# Altium schematic sheet 74VHCT14AM1.SchDoc
size A4; SheetNumber: 3; SheetTotal: 3
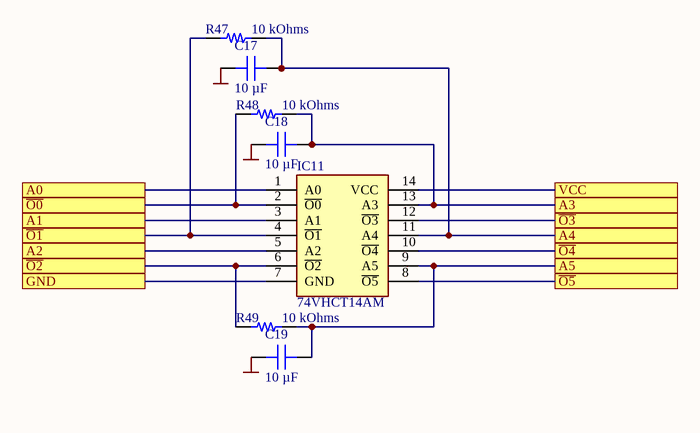
[diagram p0: 74VHCT14AM1.SchDoc]

## Parts
C17  10 µF  [CAP 0805_2012]
C18  10 µF  [CAP 0805_2012]
C19  10 µF  [CAP 0805_2012]
IC11  74VHCT14AM  [SOIC127P600X175-14N]
R47  10 kOhms  [RES 0603_1608]
R48  10 kOhms  [RES 0603_1608]
R49  10 kOhms  [RES 0603_1608]

## Ports
A0, A1, A2, A3, A4, A5, GND, VCC, ~{O0}, ~{O1}, ~{O2}, ~{O3}, ~{O4}, ~{O5}

## Nets
GND: C17.2 C18.2 C19.2
A0: IC11.1(A0) ; port A0
A1: IC11.3(A1) ; port A1
A2: IC11.5(A2) ; port A2
A3: C18.1 IC11.13(A3) R48.2 ; port A3
A4: C17.1 IC11.11(A4) R47.2 ; port A4
A5: C19.1 IC11.9(A5) R49.2 ; port A5
GND: IC11.7(GND) ; port GND  [a separate net that carries the same name]
~{O0}: IC11.2(~{O0}) R48.1 ; port ~{O0}
~{O1}: IC11.4(~{O1}) R47.1 ; port ~{O1}
~{O2}: IC11.6(~{O2}) R49.1 ; port ~{O2}
~{O3}: IC11.12(~{O3}) ; port ~{O3}
~{O4}: IC11.10(~{O4}) ; port ~{O4}
~{O5}: IC11.8(~{O5}) ; port ~{O5}
VCC: IC11.14(VCC) ; port VCC

## Library data of the parts
C17-C19 = C0805C106K8PAC7800: CAP CER 10UF 10V X5R 0805; manufacturer: KEMET; Tolerance: ±10%; Part Number: C0805C106K8PAC7800; Value: 10 µF; Applications: Bypass, Decoupling; Capacitance: 10 µF; componentlink1description: Datasheet; componentlink1url: https://connect.kemet.com:7667/gateway/IntelliData-ComponentDocumentation/1.0/download/datasheet/C0805C106K8PACTU; componentlink2description: DigiKey Link; componentlink2url: https://www.digikey.com/en/products/detail/kemet/C0805C106K8PAC7800/1090830; Device Package: 0805 (2012 Metric); lastupdated: 9/14/2022 7:51:56 AM; Lifecycle Status: Active; Minimum Order: 1; Mounting Type: Surface Mount, MLCC; Operating Temperature: -55°C ~ 85°C; Package / Case: 0805 (2012 Metric); packaging: TapeAndReel; partid: 44790; Part Status: Active; price: 0.02; series: SMD Comm X5R; Size / Dimension: 0.079" L x 0.049" W (2.00mm x 1.25mm); Supplier 1: DigiKey; Supplier Part Number 1: 399-C0805C106K8PAC7800CT-ND; Temperature Coefficient: X5R; Thickness (Max): 0.055" (1.40mm); Voltage - Rated: 10V
IC11 = 74VHCT14AM: Integrated Circuit; Manufacturer_Name: onsemi; Datasheet Link: https://docs.rs-online.com/5e2e/0900766b812cf5b5.pdf; Height: 1.75mm; Manufacturer_Part_Number: 74VHCT14AM; Mouser Part Number: 512-74VHCT14AM; Mouser Price/Stock: https://www.mouser.com/Search/Refine.aspx?Keyword=512-74VHCT14AM; Arrow Part Number: 74VHCT14AM; Arrow Price/Stock: https://www.arrow.com/en/products/74vhct14am/on-semiconductor
R47-R49 = RT0603FRE0710KL: RES SMD 10K OHM 1% 1/10W 0603; Manufacturer: Yageo; Power (Watts): 0.1W, 1/10W; Temperature Coefficient: ±50ppm/°C; Part Number: RT0603FRE0710KL; Value: 10 kOhms; ComponentLink1Description: Datasheet; ComponentLink1URL: https://www.yageo.com/upload/media/product/productsearch/datasheet/rchip/PYu-RT_1-to-0.01_RoHS_L_11.pdf; ComponentLink2Description: DigiKey Link; ComponentLink2URL: http://digikey.com/product-detail/en/yageo/RT0603FRE0710KL/YAG2321CT-ND/5252435; Composition: Thin Film; Device Package: 0603 (1608 Metric); Height - Seated (Max): 0.022" (0.55mm); LastUpdated: 9/2/2020 1:10:23 AM; Lifecycle Status: Active; Minimum Order: 1; Number of Terminations: 2; Operating Temperature: -55°C ~ 155°C; Package / Case: 0603 (1608 Metric); Packaging: TapeAndReel; PartId: 5671; Part Status: Active; Price: 0.01; Resistance: 10 kOhms; Series: RT; Size / Dimension: 0.063" L x 0.031" W (1.60mm x 0.80mm); Supplier 1: DigiKey; Supplier Part Number 1: YAG2321CT-ND; Supplier Device Package: 0603; Tolerance: ±1%